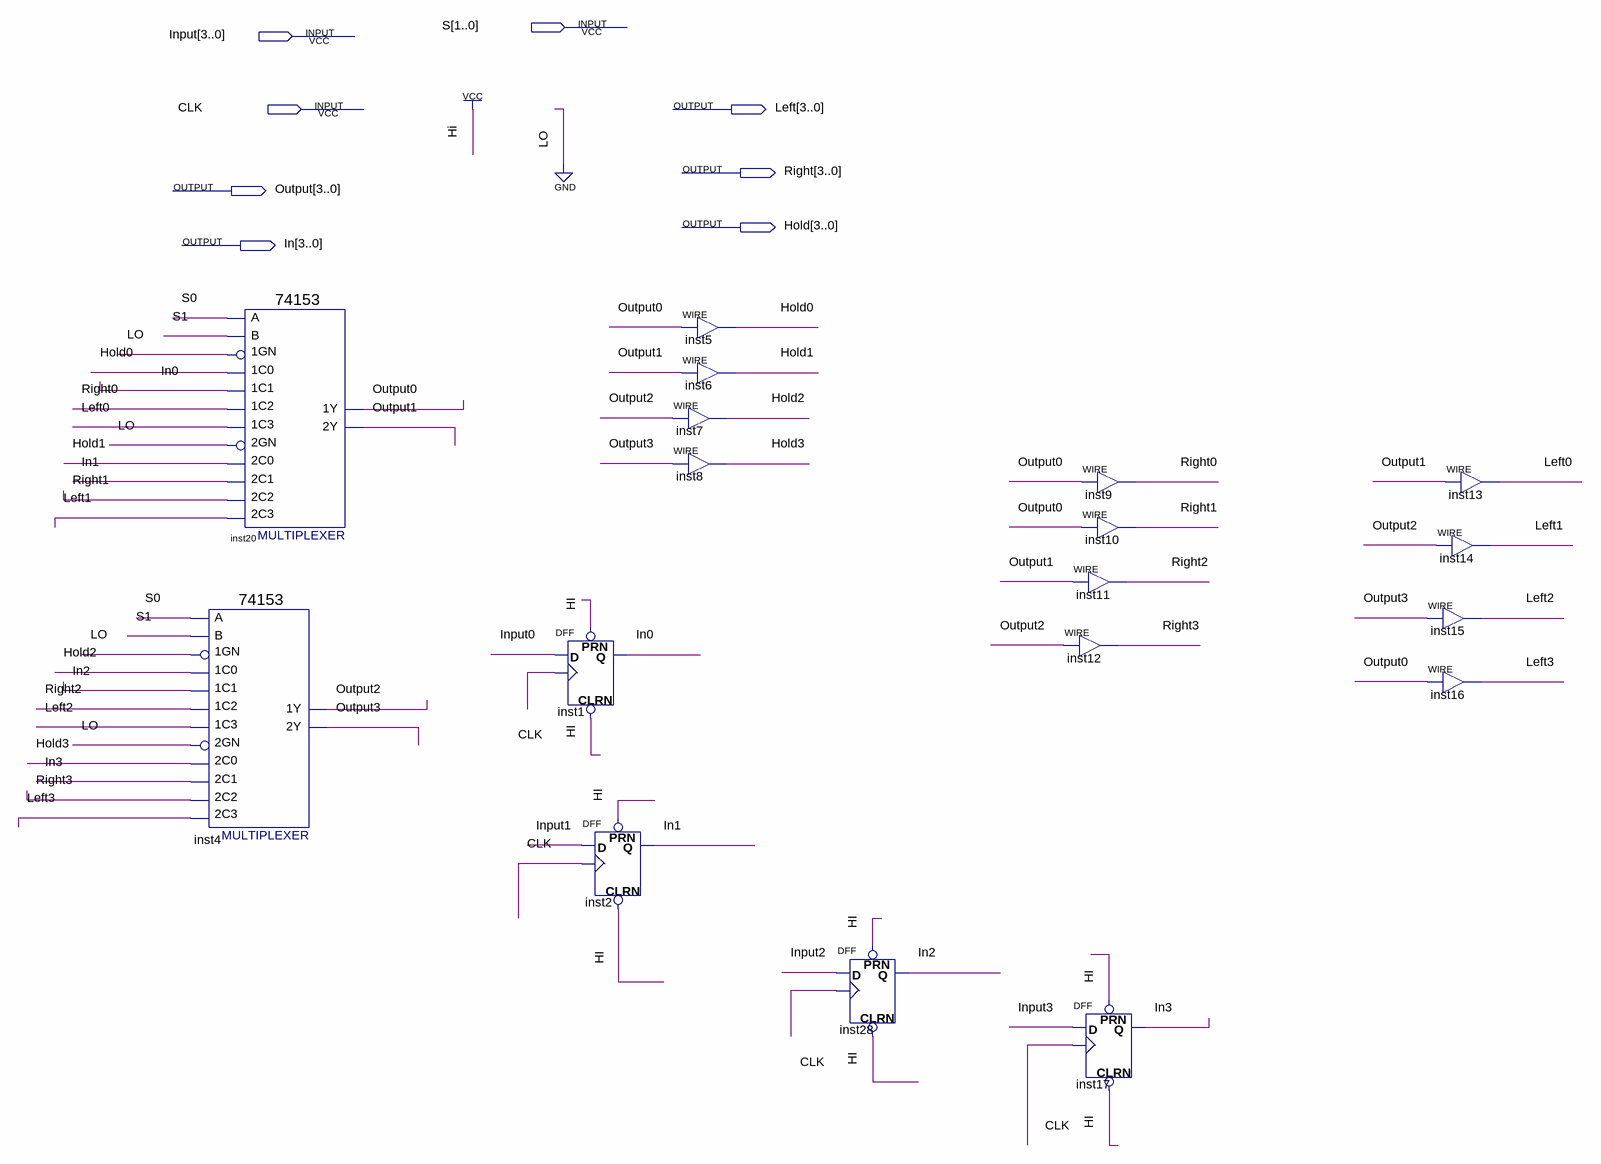
[diagram p0: schematic sheet]
// Quartus schematic quiz4.bdf as structural Verilog: 18 symbols, 8 pins
module quiz4 (
  input  [1:0] S,
  input  [3:0] Input,
  input  CLK,
  output [3:0] Left,
  output [3:0] Right,
  output [3:0] Output,
  output [3:0] Hold,
  output [3:0] In
);

  \74153  inst4 (
    .\1C1 (In[2]), .\1GN (1'b0), .\1C0 (Hold[2]), .\2C0 (Hold[3]), .\2GN (1'b0), .\2C2 (Right[3]),
    .\1C2 (Right[2]), .\1C3 (Left[2]), .B(S[1]), .A(S[0]), .\2C1 (In[3]), .\2C3 (Left[3]), .\1Y (Output[2]),
    .\2Y (Output[3]));
  \74153  inst20 (
    .\1C1 (In[0]), .\1GN (1'b0), .\1C0 (Hold[0]), .\2C0 (Hold[1]), .\2GN (1'b0), .\2C2 (Right[1]),
    .\1C2 (Right[0]), .\1C3 (Left[0]), .B(S[1]), .A(S[0]), .\2C1 (In[1]), .\2C3 (Left[1]), .\1Y (Output[0]),
    .\2Y (Output[1]));
  DFF inst1 (.CLRN(1'b1), .CLK(CLK), .D(Input[0]), .PRN(1'b1), .Q(In[0]));
  DFF inst2 (.CLRN(1'b1), .CLK(CLK), .D(Input[1]), .PRN(1'b1), .Q(In[1]));
  assign Hold[0] = Output[0];  // WIRE inst5
  assign Hold[1] = Output[1];  // WIRE inst6
  assign Hold[2] = Output[2];  // WIRE inst7
  assign Hold[3] = Output[3];  // WIRE inst8
  DFF inst28 (.CLRN(1'b1), .CLK(CLK), .D(Input[2]), .PRN(1'b1), .Q(In[2]));
  assign Right[0] = Output[0];  // WIRE inst9
  assign Right[1] = Output[0];  // WIRE inst10
  assign Right[2] = Output[1];  // WIRE inst11
  assign Right[3] = Output[2];  // WIRE inst12
  DFF inst17 (.CLRN(1'b1), .CLK(CLK), .D(Input[3]), .PRN(1'b1), .Q(In[3]));
  assign Left[0] = Output[1];  // WIRE inst13
  assign Left[1] = Output[2];  // WIRE inst14
  assign Left[2] = Output[3];  // WIRE inst15
  assign Left[3] = Output[0];  // WIRE inst16
endmodule
